# EasyEDA schematic LOTP ESP32 MCU V3.json
TITLE: LOTP ESP32 MCU; REV: 1.0; Date: 2022-06-26; Sheet: 1/1; Drawn By: Halid Yildirim; Company: -
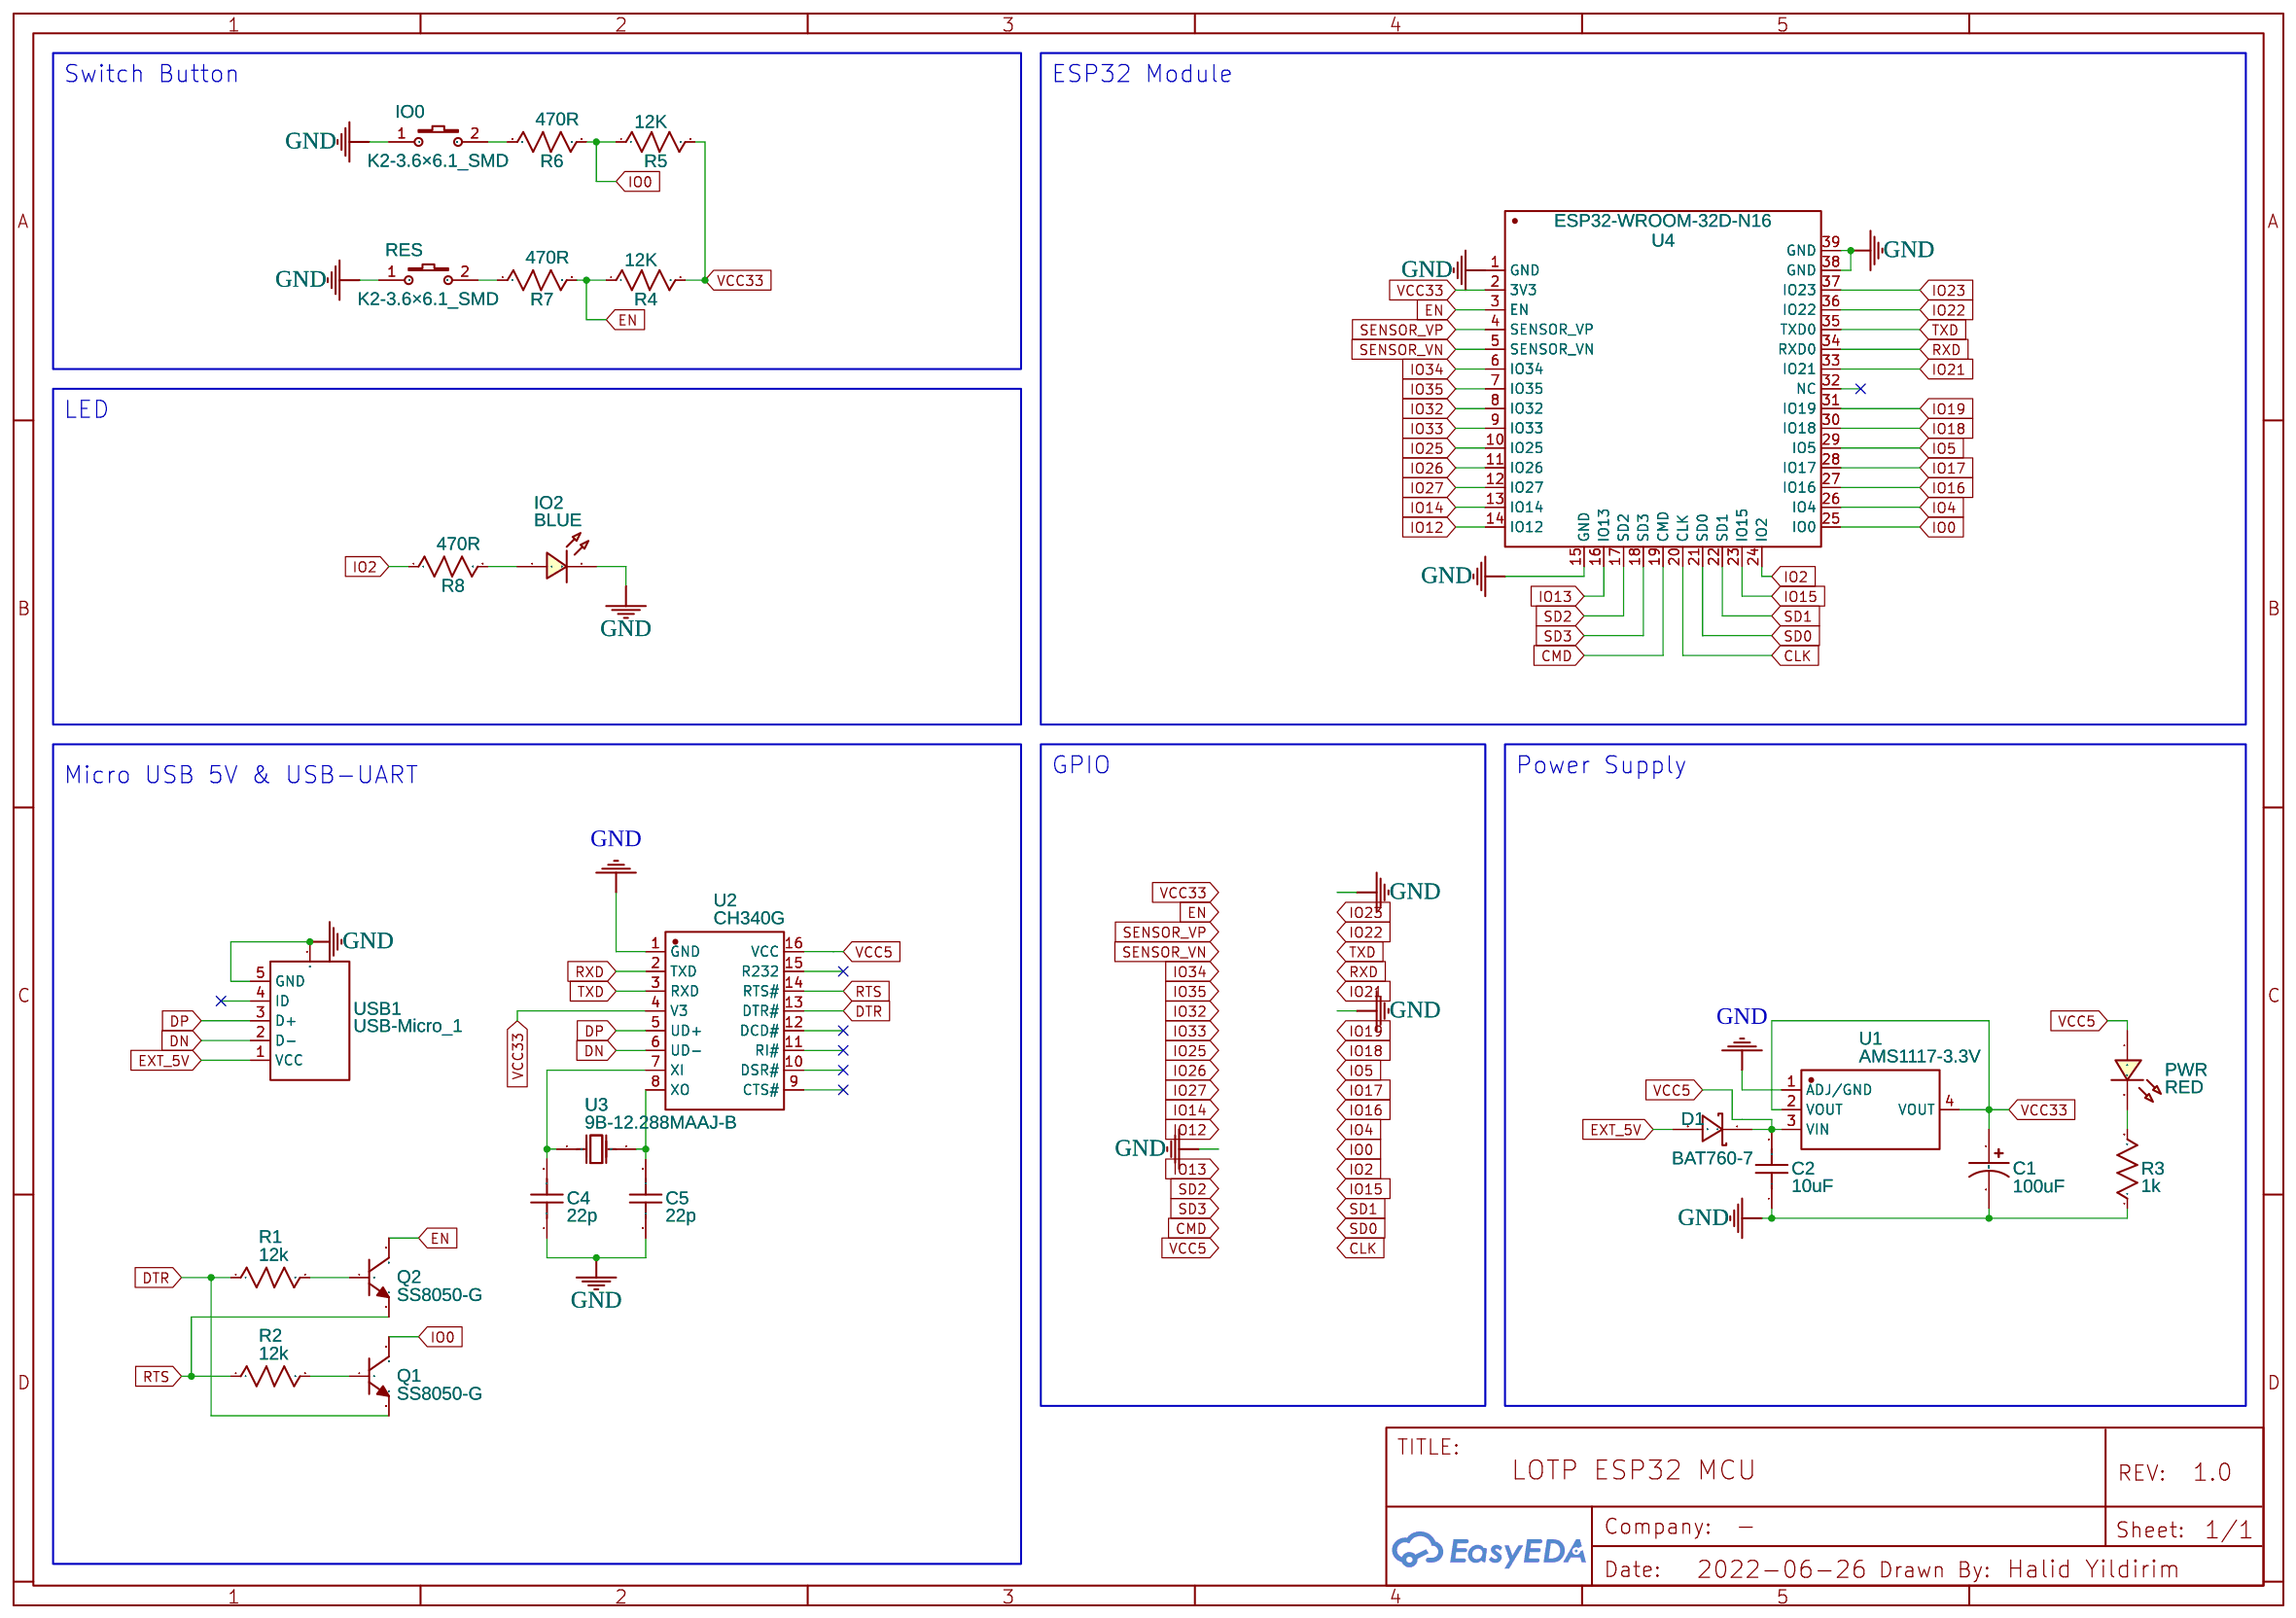
[diagram p0: schematic sheet]

## Parts
C1  100uF  [CASE-C_6032]
C2  10uF  [C0603]
C4  22p  [C0603]
C5  22p  [C0603]
D1  BAT760-7  [SOD-323_L1.8-W1.3-LS2.5-RD]
IO0  K2-3.6×6.1_SMD  [KEY-SMD_2P-L6.2-W3.6-LS8.0]
IO2  BLUE  [LED0603_RED]
PWR  RED  [LED0603_RED]
Q1  SS8050-G  [SOT-23-3_L2.9-W1.6-P1.90-LS2.8-BR]
Q2  SS8050-G  [SOT-23-3_L2.9-W1.6-P1.90-LS2.8-BR]
R1  12k  [R0603]
R2  12k  [R0603]
R3  1k  [R0603]
R4  12K  [R0603]
R5  12K  [R0603]
R6  470R  [R0603]
R7  470R  [R0603]
R8  470R  [R0603]
RES  K2-3.6×6.1_SMD  [KEY-SMD_2P-L6.2-W3.6-LS8.0]
U1  AMS1117-3.3V  [SOT-223-4_L6.5-W3.5-P2.30-LS7.0-BR]
U2  CH340G  [SOIC-16_L9.9-W3.9-P1.27-LS6.0-BL]
U3  9B-12.288MAAJ-B  [HC-49SMD_L11.1-W4.8]
U4  ESP32-WROOM-32D-N16  [WIFIM-SMD_ESP32-WROOM-32D]
USB1  USB-Micro_1  [MICRO-USB-SMD_5P-P0.65-H-F_C10418]

## Library data of the parts
C1 = C_Tan_SMD_A_US: Contributor: LCEDA_Lib
C2 C4 C5 = C_0603_US: Contributor: LCEDA_Lib
D1 = BAT760-7: Supplier: LCSC; Manufacturer: DIODES; Contributor: LCSC; Supplier Part: C124187; JLCPCB Part Class: Extended Part
IO0 RES = K2-3.6×6.1_SMD: Supplier Part: C118141; Supplier: LCSC; Manufacturer Part: K2-1107ST-A4SW-06; Contributor: LCEDA_Lib; 制造商: 韩国韩荣
IO2 PWR = LED-0603_R: Manufacturer: EVERLIGHT(台湾亿光); Manufacturer Part: 19-217/R6C-AL1M2VY/3T; Supplier Part: C72044; Supplier: LCSC; Contributor: LCEDA_01
Q1 Q2 = SS8050-G: Supplier: LCSC; Manufacturer: CJ; Contributor: LCSC; Supplier Part: C164886; JLCPCB Part Class: Extended Part
R1-R8 = R_0603_US: Contributor: LCEDA_Lib
U1 = AMS1117-3.3V: Supplier: LCSC; Supplier Part: C2688239; Manufacturer: WPMtek(维攀微); Contributor: LCSC; JLCPCB Part Class: Extended Part
U2 = CH340G: Supplier: LCSC; Manufacturer: WCH; Supplier Part: C14267; JLCPCB Part Class: Extended Part
U3 = 9B-12.288MAAJ-B: Supplier: LCSC; Supplier Part: C2636382; Manufacturer: TXC(台湾晶技); Contributor: LCSC; JLCPCB Part Class: Extended Part
U4 = ESP32-WROOM-32D-N16: Supplier: LCSC; Supplier Part: C2973676; Manufacturer: ESPRESSIF 乐鑫; link: https://atta.szlcsc.comnull; Contributor: lcsc
USB1 = USB-Micro_1: Supplier Part: C10418; Supplier: LCSC; Manufacturer: ValuePro; Contributor: LCEDA_Lib

## Nets
GND: C1.2 C2.1 C4.1 C5.1 IO0.1 IO2.2 R3.1 RES.1 U1.1(ADJ/GND) U2.1(GND) U4.1(GND) U4.15(GND) U4.38(GND) U4.39(GND) USB1.0(MTN) USB1.5(GND)
VCC5: C2.2 D1.1 PWR.1 U1.3(VIN) U2.16(VCC)
VCC33: C1.1 R4.2 R5.2 U1.2(VOUT) U1.4(VOUT) U2.4(V3) U4.2(3V3)
CLK: U4.20(CLK)
CMD: U4.19(CMD)
DN: U2.6(UD-) USB1.2(D-)
DP: U2.5(UD+) USB1.3(D+)
DTR: Q1.2(E) R1.1 U2.13(DTR#)
EN: Q2.3(C) R4.1 R7.2 U4.3(EN)
EXT_5V: D1.2 USB1.1(VCC)
IO0: Q1.3(C) R5.1 R6.2 U4.25(IO0)
IO2: R8.1 U4.24(IO2)
IO4: U4.26(IO4)
IO5: U4.29(IO5)
IO12: U4.14(IO12)
IO13: U4.16(IO13)
IO14: U4.13(IO14)
IO15: U4.23(IO15)
IO16: U4.27(IO16)
IO17: U4.28(IO17)
IO18: U4.30(IO18)
IO19: U4.31(IO19)
IO21: U4.33(IO21)
IO22: U4.36(IO22)
IO23: U4.37(IO23)
IO25: U4.10(IO25)
IO26: U4.11(IO26)
IO27: U4.12(IO27)
IO32: U4.8(IO32)
IO33: U4.9(IO33)
IO34: U4.6(IO34)
IO35: U4.7(IO35)
RTS: Q2.2(E) R2.1 U2.14(RTS#)
RXD: U2.2(TXD) U4.34(RXD0)
SD0: U4.21(SD0)
SD1: U4.22(SD1)
SD2: U4.17(SD2)
SD3: U4.18(SD3)
SENSOR_VN: U4.5(SENSOR_VN)
SENSOR_VP: U4.4(SENSOR_VP)
TXD: U2.3(RXD) U4.35(TXD0)
Net-(C4-2): C4.2 U2.7(XI) U3.1(OSC1)
Net-(C5-2): C5.2 U2.8(XO) U3.2(OSC2)
Net-(IO0-2): IO0.2 R6.1
Net-(IO2-1): IO2.1 R8.2
Net-(PWR-2): PWR.2 R3.2
Net-(Q1-1): Q1.1(B) R2.2
Net-(Q2-1): Q2.1(B) R1.2
Net-(R7-1): R7.1 RES.2

Not connected (* = marked no-connect by the designer): U2 9(CTS#) 10(DSR#) 11(RI#) 12(DCD#) 15(R232); U4 32(NC); USB1 4(ID)

## Notes on the sheet
- Switch Button
- ESP32 Module
- LED
- Micro USB 5V & USB-UART
- GPIO
- Power Supply
